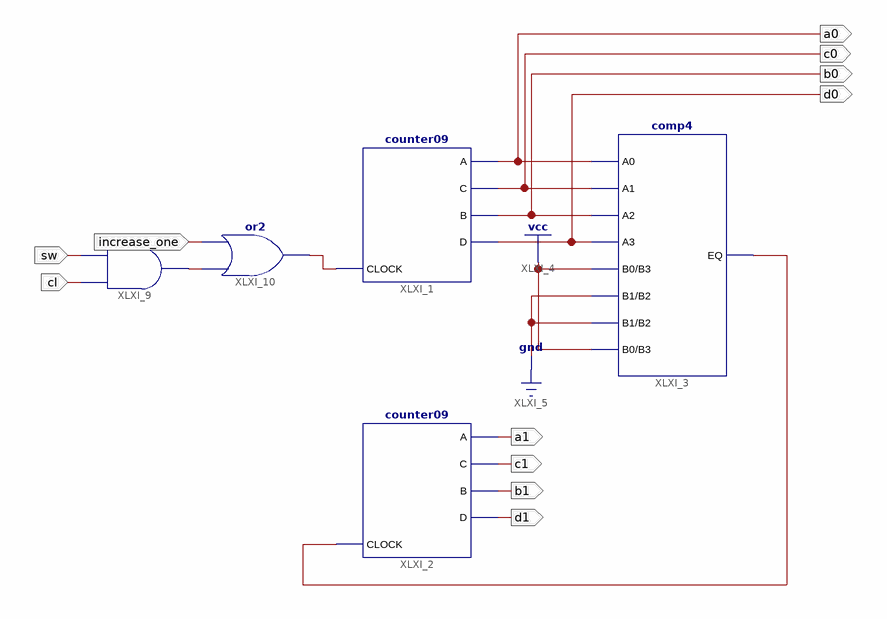
[diagram p0: schematic sheet 1]
// Xilinx ISE schematic multiCounter.sch (spartan6) as structural Verilog: 5 symbols, 11 ports
module multiCounter (
  input  sw,
  input  cl,
  input  increase_one,
  output a0,
  output c0,
  output b0,
  output d0,
  output a1,
  output c1,
  output b1,
  output d1
);

  wire XLXN_8, XLXN_11, XLXN_12;

  counter09 XLXI_1 (.CLOCK(XLXN_12), .A(a0), .C(c0), .B(b0), .D(d0));
  counter09 XLXI_2 (.CLOCK(XLXN_8), .A(a1), .C(c1), .B(b1), .D(d1));
  comp4 XLXI_3 (.A0(a0), .A1(c0), .A2(b0), .A3(d0), .B0(1'b1), .B1(1'b0), .B2(1'b0), .B3(1'b1), .EQ(XLXN_8));
  and XLXI_9 (XLXN_11, cl, sw);
  or XLXI_10 (XLXN_12, XLXN_11, increase_one);
endmodule
